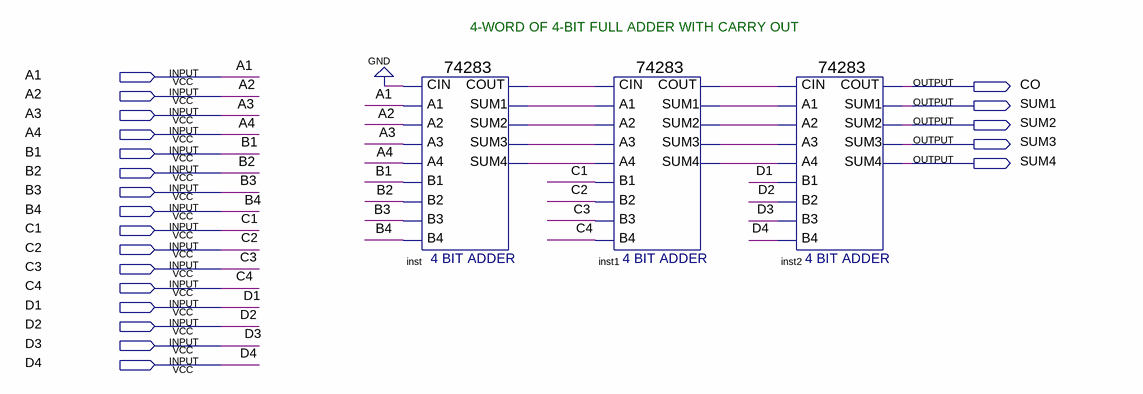
[diagram p0: schematic sheet]
// Quartus schematic 4WORD4BIT_FA.bdf as structural Verilog: 3 symbols, 21 pins
module \4WORD4BIT_FA  (
  input  A1,
  input  A2,
  input  A3,
  input  A4,
  input  B1,
  input  B2,
  input  B3,
  input  B4,
  input  C1,
  input  C2,
  input  C3,
  input  C4,
  input  D1,
  input  D2,
  input  D3,
  input  D4,
  output CO,
  output SUM1,
  output SUM2,
  output SUM3,
  output SUM4
);

  wire inst1_cout, inst1_sum1, inst1_sum2, inst1_sum3, inst1_sum4, inst_cout, inst_sum1, inst_sum2,
       inst_sum3, inst_sum4;

  \74283  inst (
    .CIN(1'b0), .A1(A1), .A2(A2), .B2(B2), .A3(A3), .A4(A4), .B4(B4), .B1(B1), .B3(B3), .SUM4(inst_sum4),
    .COUT(inst_cout), .SUM1(inst_sum1), .SUM2(inst_sum2), .SUM3(inst_sum3));
  \74283  inst1 (
    .CIN(inst_cout), .A1(inst_sum1), .A2(inst_sum2), .B2(C2), .A3(inst_sum3), .A4(inst_sum4), .B4(C4),
    .B1(C1), .B3(C3), .SUM4(inst1_sum4), .COUT(inst1_cout), .SUM1(inst1_sum1), .SUM2(inst1_sum2),
    .SUM3(inst1_sum3));
  \74283  inst2 (
    .CIN(inst1_cout), .A1(inst1_sum1), .A2(inst1_sum2), .B2(D2), .A3(inst1_sum3), .A4(inst1_sum4), .B4(D4),
    .B1(D1), .B3(D3), .SUM4(SUM4), .COUT(CO), .SUM1(SUM1), .SUM2(SUM2), .SUM3(SUM3));

  // Notes on the sheet:
  //   4-WORD OF 4-BIT FULL ADDER WITH CARRY OUT
endmodule
